# EAGLE schematic led-controller-hw (EAGLE 7.5.0)
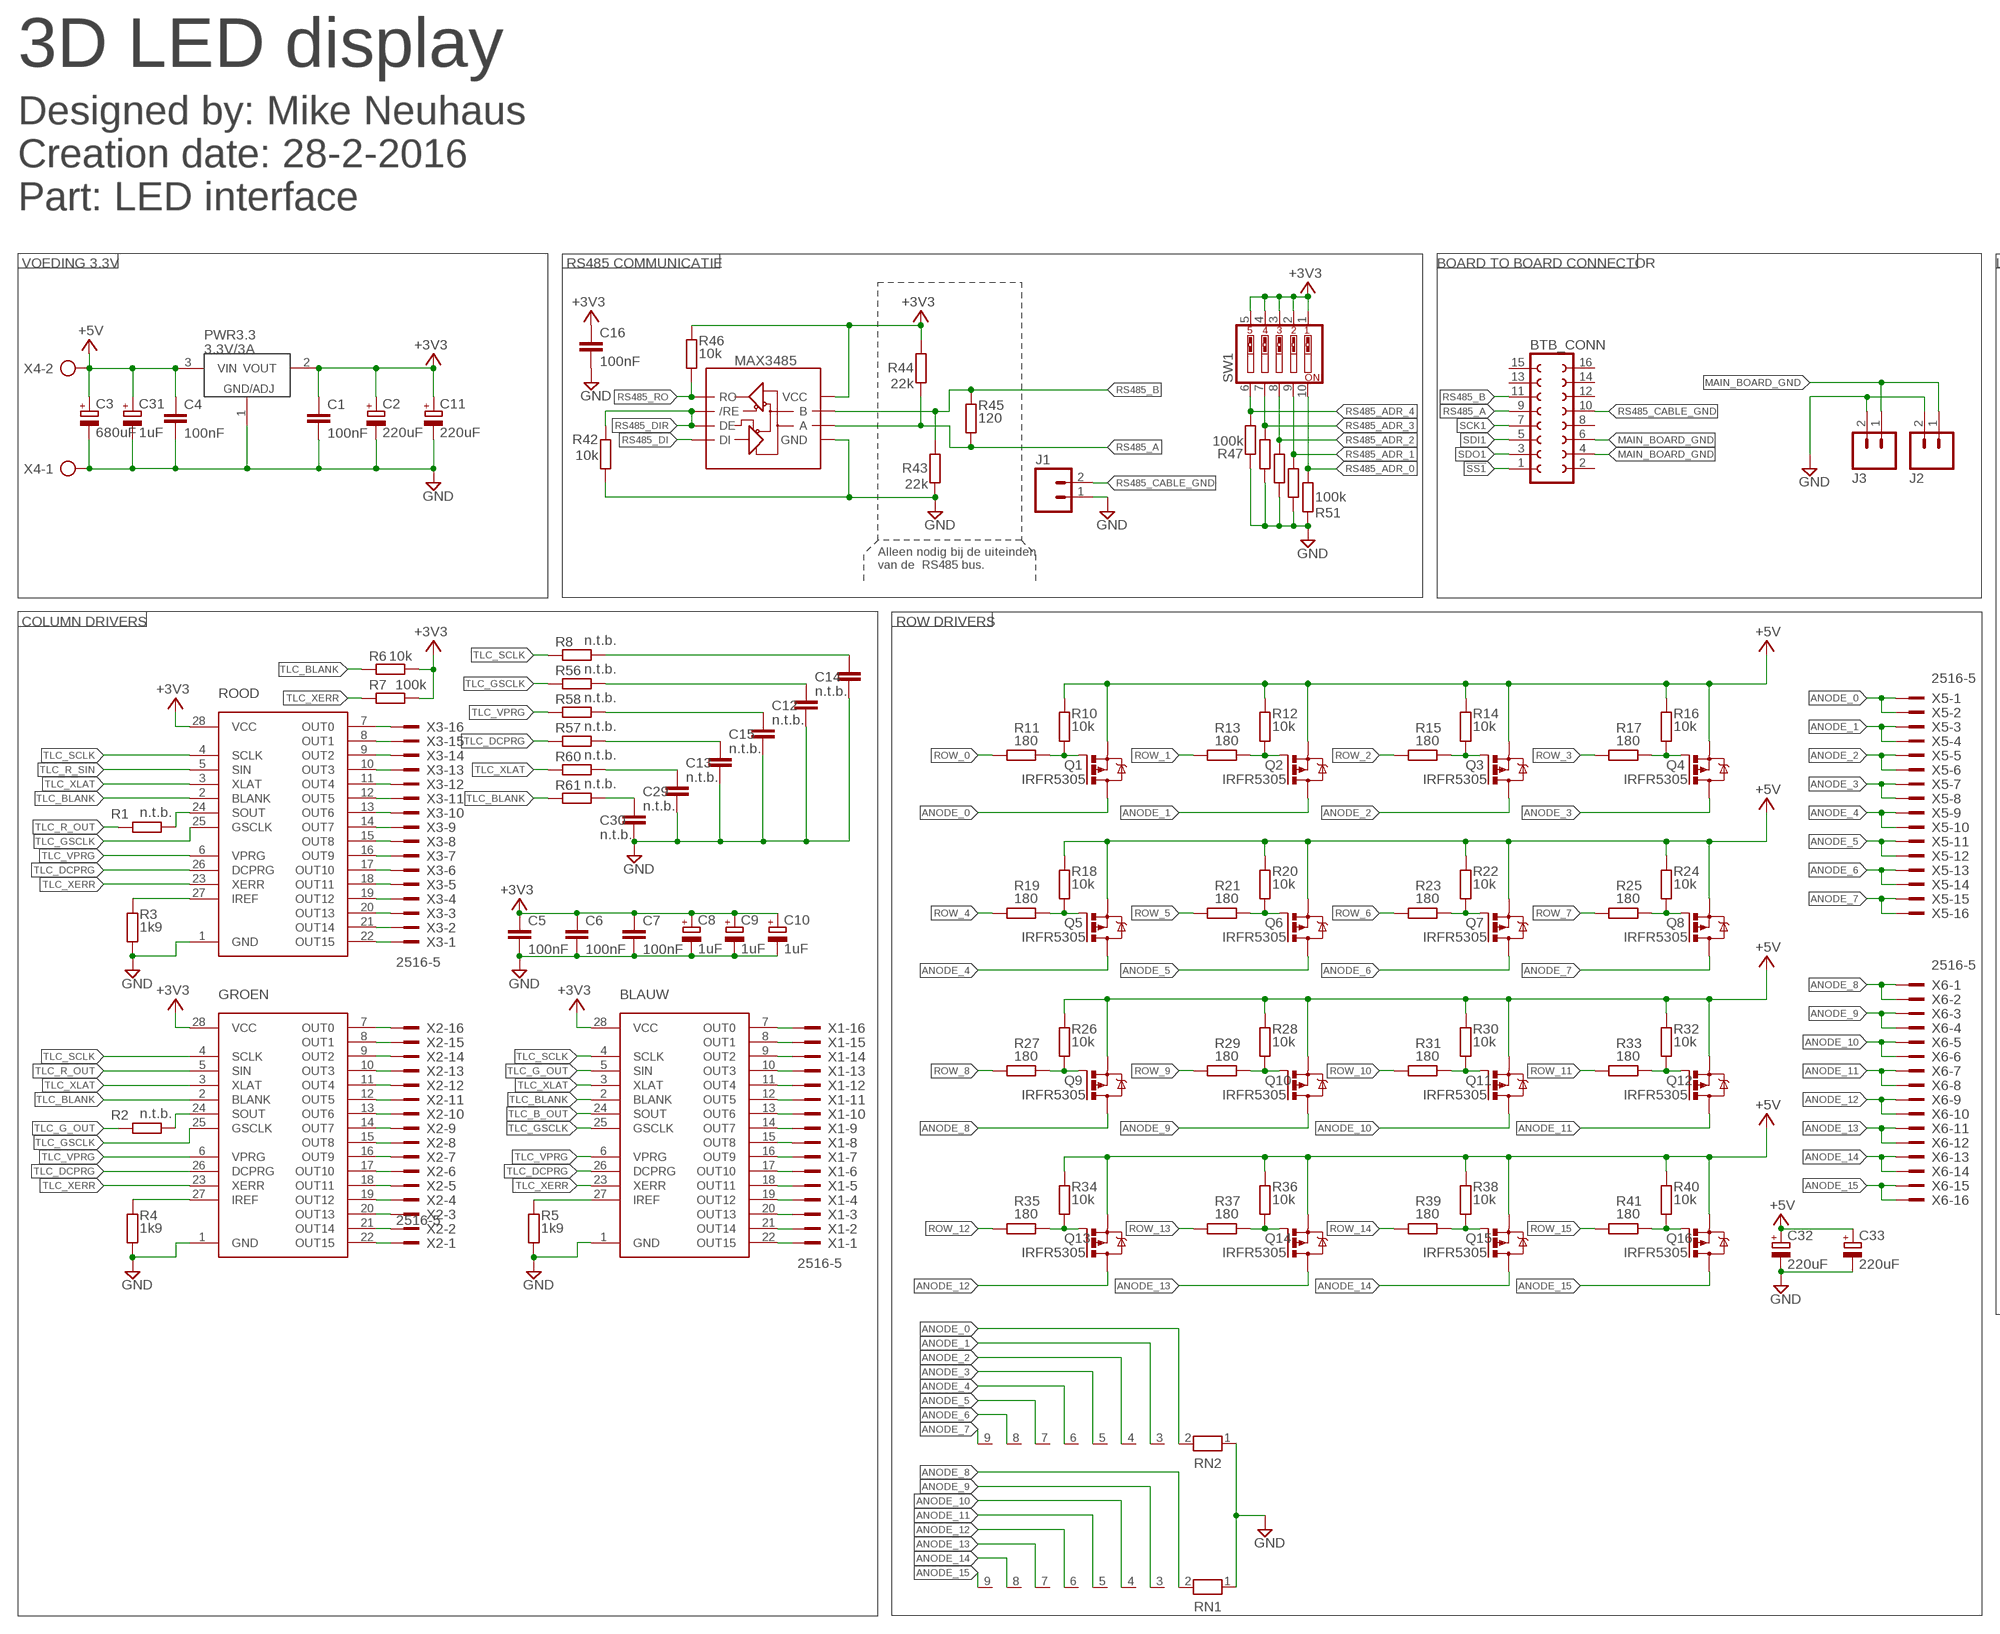
[diagram p0: schematic, sheet 1, part 1 of 2]
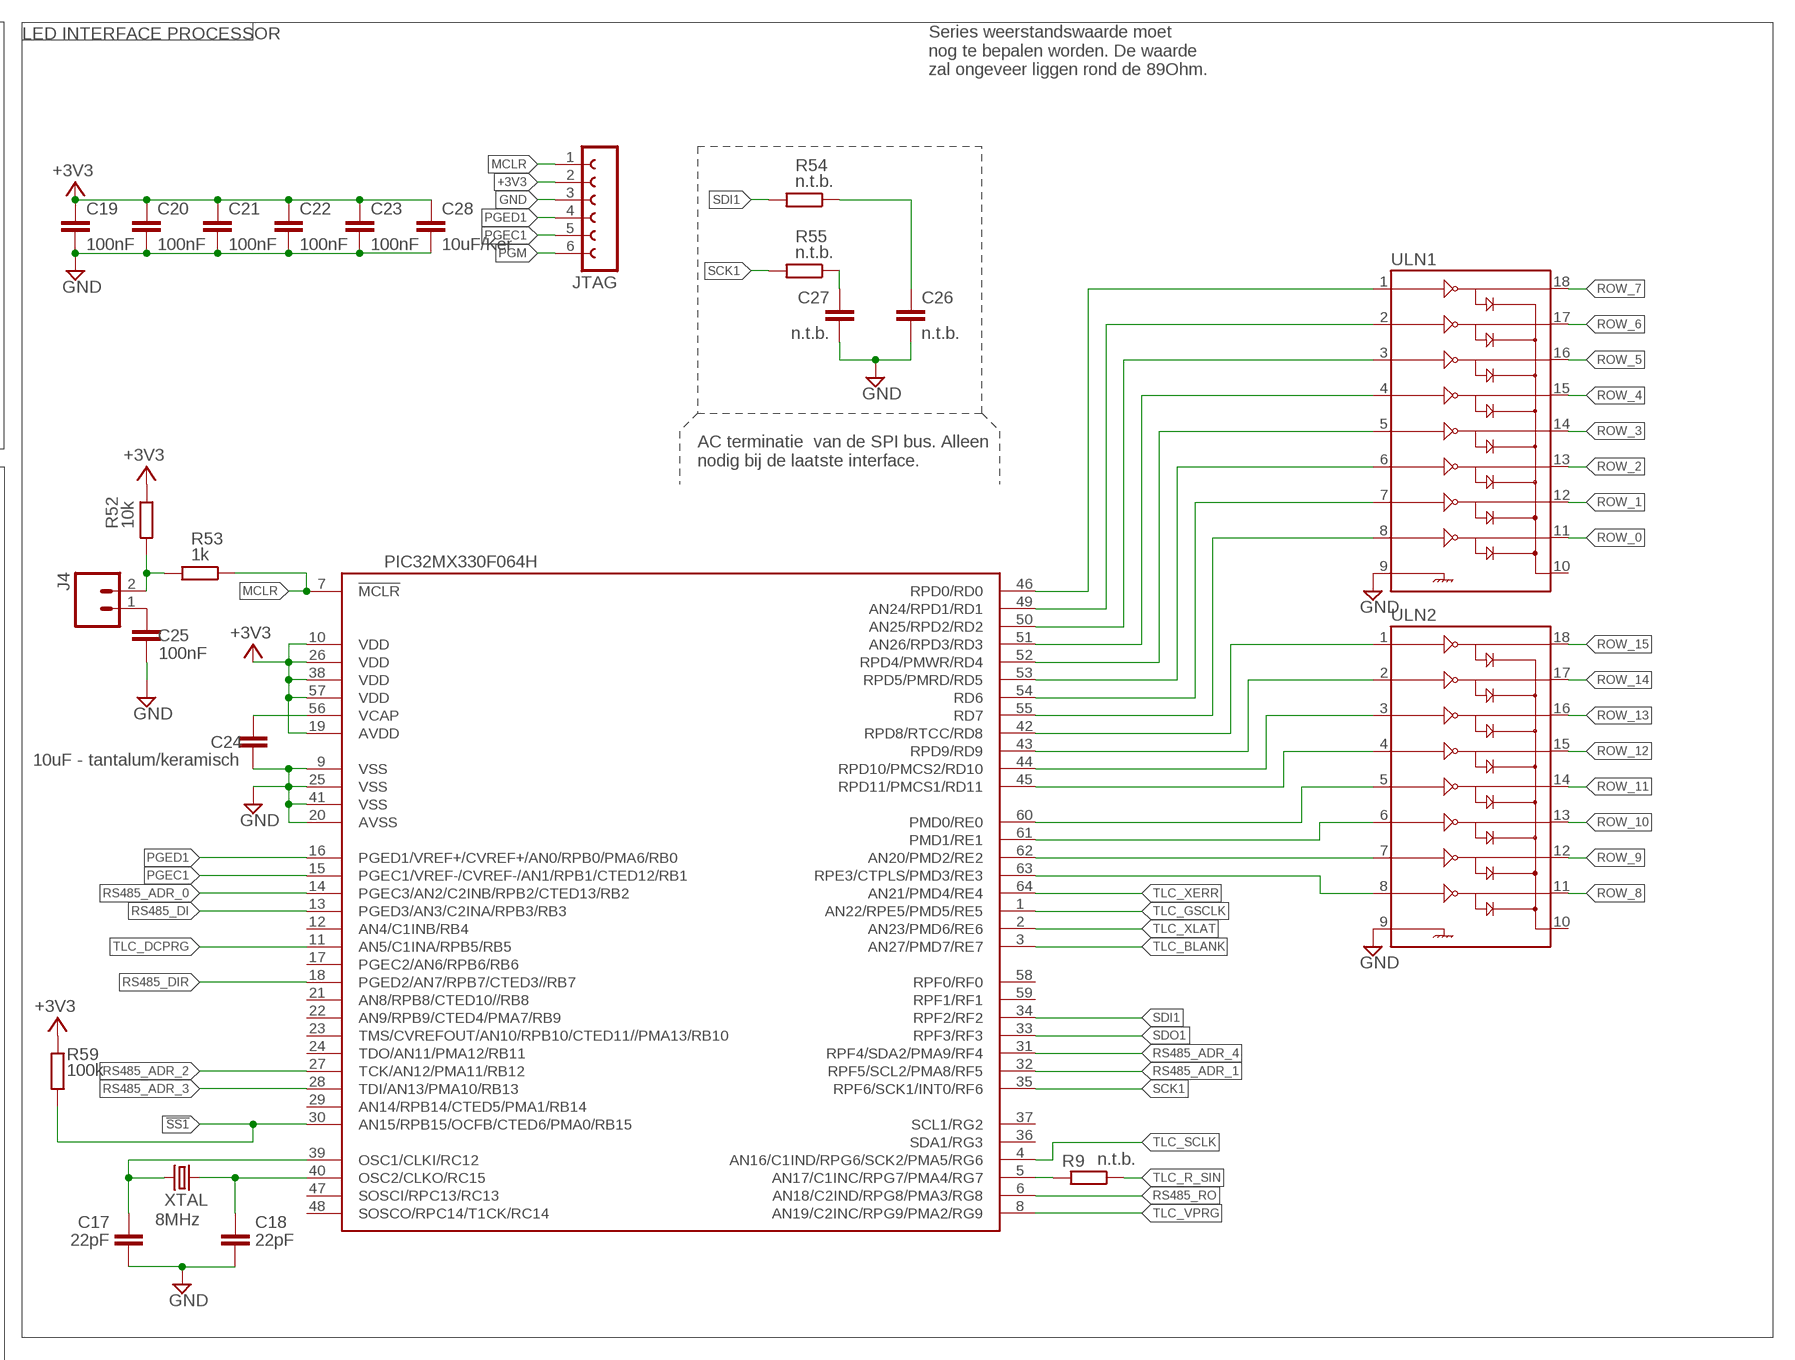
[diagram p1: schematic, sheet 1, part 2 of 2]

## Parts
BLAUW  TLC5940PWPR  [TSSOP-28-PWP]
BTB_CONN  FE08-2W  [FE08-2W]
C1  100nF  C-EUC0805  [C0805]
C2  220uF  CPOL-EUE2,5-6E  [E2,5-6E]
C3  680uF  CPOL_EU10-27-5  [CPOL_EU10-27]
C4  100nF  C-EUC0805  [C0805]
C5  100nF  C-EUC0805  [C0805]
C6  100nF  C-EUC0805  [C0805]
C7  100nF  C-EUC0805  [C0805]
C8  1uF  CPOL-EUE2.5-5  [E2,5-5]
C9  1uF  CPOL-EUE2.5-5  [E2,5-5]
C10  1uF  CPOL-EUE2.5-5  [E2,5-5]
C11  220uF  CPOL-EUE2,5-6E  [E2,5-6E]
C12  n.t.b.  C-EUC0805  [C0805]
C13  n.t.b.  C-EUC0805  [C0805]
C14  n.t.b.  C-EUC0805  [C0805]
C15  n.t.b.  C-EUC0805  [C0805]
C16  100nF  C-EUC0805  [C0805]
C17  22pF  C-EUC0805  [C0805]
C18  22pF  C-EUC0805  [C0805]
C19  100nF  C-EUC0805  [C0805]
C20  100nF  C-EUC0805  [C0805]
C21  100nF  C-EUC0805  [C0805]
C22  100nF  C-EUC0805  [C0805]
C23  100nF  C-EUC0805  [C0805]
C24  10uF - tantalum/keramisch  C-EUC0805  [C0805]
C25  100nF  C-EUC0805  [C0805]
C26  n.t.b.  C-EUC0805  [C0805]
C27  n.t.b.  C-EUC0805  [C0805]
C28  10uF/Ker  C-EUC0805  [C0805]
C29  n.t.b.  C-EUC0805  [C0805]
C30  n.t.b.  C-EUC0805  [C0805]
C31  1uF  CPOL-EUE2.5-5  [E2,5-5]
C32  220uF  CPOL-EUE2,5-6E  [E2,5-6E]
C33  220uF  CPOL-EUE2,5-6E  [E2,5-6E]
GROEN  TLC5940PWPR  [TSSOP-28-PWP]
J1  M02LOCK  [1X02_LOCK]
J2  M02LOCK  [1X02_LOCK]
J3  M02LOCK  [1X02_LOCK]
J4  M02LOCK  [1X02_LOCK]
JTAG  FE06-1  [FE06]
MAX3485  RS485SOIC  [SO08]
PIC32MX330F064H  PIC32MX330F064H  [TQFP-64-10]
PWR3.3  3.3V/3A  LM1085-3.3  [TO-220]
Q1  IRFR5305  [D-PAK_TO252AA]
Q2  IRFR5305  [D-PAK_TO252AA]
Q3  IRFR5305  [D-PAK_TO252AA]
Q4  IRFR5305  [D-PAK_TO252AA]
Q5  IRFR5305  [D-PAK_TO252AA]
Q6  IRFR5305  [D-PAK_TO252AA]
Q7  IRFR5305  [D-PAK_TO252AA]
Q8  IRFR5305  [D-PAK_TO252AA]
Q9  IRFR5305  [D-PAK_TO252AA]
Q10  IRFR5305  [D-PAK_TO252AA]
Q11  IRFR5305  [D-PAK_TO252AA]
Q12  IRFR5305  [D-PAK_TO252AA]
Q13  IRFR5305  [D-PAK_TO252AA]
Q14  IRFR5305  [D-PAK_TO252AA]
Q15  IRFR5305  [D-PAK_TO252AA]
Q16  IRFR5305  [D-PAK_TO252AA]
R1  n.t.b.  R-EU_M0805  [M0805]
R2  n.t.b.  R-EU_M0805  [M0805]
R3  1k9  R-EU_M0805  [M0805]
R4  1k9  R-EU_M0805  [M0805]
R5  1k9  R-EU_M0805  [M0805]
R6  10k  R-EU_M0805  [M0805]
R7  100k  R-EU_M0805  [M0805]
R8  n.t.b.  R-EU_M0805  [M0805]
R9  n.t.b.  R-EU_M0805  [M0805]
R10  10k  R-EU_M0805  [M0805]
R11  180  R-EU_M0805  [M0805]
R12  10k  R-EU_M0805  [M0805]
R13  180  R-EU_M0805  [M0805]
R14  10k  R-EU_M0805  [M0805]
R15  180  R-EU_M0805  [M0805]
R16  10k  R-EU_M0805  [M0805]
R17  180  R-EU_M0805  [M0805]
R18  10k  R-EU_M0805  [M0805]
R19  180  R-EU_M0805  [M0805]
R20  10k  R-EU_M0805  [M0805]
R21  180  R-EU_M0805  [M0805]
R22  10k  R-EU_M0805  [M0805]
R23  180  R-EU_M0805  [M0805]
R24  10k  R-EU_M0805  [M0805]
R25  180  R-EU_M0805  [M0805]
R26  10k  R-EU_M0805  [M0805]
R27  180  R-EU_M0805  [M0805]
R28  10k  R-EU_M0805  [M0805]
R29  180  R-EU_M0805  [M0805]
R30  10k  R-EU_M0805  [M0805]
R31  180  R-EU_M0805  [M0805]
R32  10k  R-EU_M0805  [M0805]
R33  180  R-EU_M0805  [M0805]
R34  10k  R-EU_M0805  [M0805]
R35  180  R-EU_M0805  [M0805]
R36  10k  R-EU_M0805  [M0805]
R37  180  R-EU_M0805  [M0805]
R38  10k  R-EU_M0805  [M0805]
R39  180  R-EU_M0805  [M0805]
R40  10k  R-EU_M0805  [M0805]
R41  180  R-EU_M0805  [M0805]
R42  10k  R-EU_M0805  [M0805]
R43  22k  R-EU_M0805  [M0805]
R44  22k  R-EU_M0805  [M0805]
R45  120  R-EU_M0805  [M0805]
R46  10k  R-EU_M0805  [M0805]
R47  100k  R-EU_M0805  [M0805]
R48  100k  R-EU_M0805  [M0805]
R49  100k  R-EU_M0805  [M0805]
R50  100k  R-EU_M0805  [M0805]
R51  100k  R-EU_M0805  [M0805]
R52  10k  R-EU_M0805  [M0805]
R53  1k  R-EU_M0805  [M0805]
R54  n.t.b.  R-EU_M0805  [M0805]
R55  n.t.b.  R-EU_M0805  [M0805]
R56  n.t.b.  R-EU_M0805  [M0805]
R57  n.t.b.  R-EU_M0805  [M0805]
R58  n.t.b.  R-EU_M0805  [M0805]
R59  100k  R-EU_M0805  [M0805]
R60  n.t.b.  R-EU_M0805  [M0805]
R61  n.t.b.  R-EU_M0805  [M0805]
RN1  RN08  [RN-9]
RN2  RN08  [RN-9]
ROOD  TLC5940PWPR  [TSSOP-28-PWP]
SW1  SW_DIP-5  [EDG-05]
ULN1  ULN2803SOICW  [SO18L]
ULN2  ULN2803SOICW  [SO18L]
X1  2516-5  [PAK100/2500-5-16]
X2  2516-5  [PAK100/2500-5-16]
X3  2516-5  [PAK100/2500-5-16]
X4  AK500/2-H  [AK500/2-H]
X5  2516-5  [PAK100/2500-5-16]
X6  2516-5  [PAK100/2500-5-16]
XTAL  8MHz  CSM-7X-DU  [CSM-7X-DU]

## Nets
!SS1: BTB_CONN.1 PIC32MX330F064H.30(AN15/RPB15/OCFB/CTED6/PMA0/RB15) R59.2
+3V3: BLAUW.28(VCC) C1.1 C2.+ C5.1 C6.1 C7.1 C8.+ C9.+ C10.+ C11.+ C16.1 C19.1 C20.1 C21.1 C22.1 C23.1 C28.1 GROEN.28(VCC) JTAG.2 MAX3485.8(VCC) PIC32MX330F064H.10(VDD) PIC32MX330F064H.19(AVDD) PIC32MX330F064H.26(VDD) PIC32MX330F064H.38(VDD) PIC32MX330F064H.57(VDD) PWR3.3.2(VOUT) R6.2 R7.2 R44.1 R46.2 R52.1 R59.1 ROOD.28(VCC) SW1.1 SW1.2 SW1.3 SW1.4 SW1.5
+5V: C3.1(+) C4.1 C31.+ C32.+ C33.+ PWR3.3.3(VIN) Q1.3(S) Q2.3(S) Q3.3(S) Q4.3(S) Q5.3(S) Q6.3(S) Q7.3(S) Q8.3(S) Q9.3(S) Q10.3(S) Q11.3(S) Q12.3(S) Q13.3(S) Q14.3(S) Q15.3(S) Q16.3(S) R10.2 R12.2 R14.2 R16.2 R18.2 R20.2 R22.2 R24.2 R26.2 R28.2 R30.2 R32.2 R34.2 R36.2 R38.2 R40.2 X4.2
ANODE_0: Q1.4(D) RN2.2 X5.1 X5.2
ANODE_1: Q2.4(D) RN2.3 X5.3 X5.4
ANODE_2: Q3.4(D) RN2.4 X5.5 X5.6
ANODE_3: Q4.4(D) RN2.5 X5.7 X5.8
ANODE_4: Q5.4(D) RN2.6 X5.9 X5.10
ANODE_5: Q6.4(D) RN2.7 X5.11 X5.12
ANODE_6: Q7.4(D) RN2.8 X5.13 X5.14
ANODE_7: Q8.4(D) RN2.9 X5.15 X5.16
ANODE_8: Q9.4(D) RN1.2 X6.1 X6.2
ANODE_9: Q10.4(D) RN1.3 X6.3 X6.4
ANODE_10: Q11.4(D) RN1.4 X6.5 X6.6
ANODE_11: Q12.4(D) RN1.5 X6.7 X6.8
ANODE_12: Q13.4(D) RN1.6 X6.9 X6.10
ANODE_13: Q14.4(D) RN1.7 X6.11 X6.12
ANODE_14: Q15.4(D) RN1.8 X6.13 X6.14
ANODE_15: Q16.4(D) RN1.9 X6.15 X6.16
GND: BLAUW.1(GND) C1.2 C2.- C3.2(-) C4.2 C5.2 C6.2 C7.2 C8.- C9.- C10.- C11.- C12.2 C13.2 C14.2 C15.2 C16.2 C17.1 C18.1 C19.2 C20.2 C21.2 C22.2 C23.2 C24.2 C25.2 C26.2 C27.2 C28.2 C29.2 C30.2 C31.- C32.- C33.- GROEN.1(GND) J1.1 J2.2 J3.2 JTAG.3 MAX3485.5(GND) PIC32MX330F064H.9(VSS) PIC32MX330F064H.20(AVSS) PIC32MX330F064H.25(VSS) PIC32MX330F064H.41(VSS) PWR3.3.1(GND/ADJ) R3.1 R4.1 R5.1 R42.2 R43.2 R47.1 R48.1 R49.1 R50.1 R51.1 RN1.1 RN2.1 ROOD.1(GND) ULN1.9 ULN2.9 X4.1
MAIN_BOARD_GND: BTB_CONN.4 BTB_CONN.6 J2.1 J3.1
MCLR: JTAG.1 PIC32MX330F064H.7(!MCLR) R53.1
N$1: C13.1 R57.1
N$2: Q1.1(G) R10.1 R11.1
N$3: R3.2 ROOD.27(IREF)
N$4: BLAUW.27(IREF) R5.2
N$5: GROEN.27(IREF) R4.2
N$6: ROOD.22(OUT15) X3.1
N$7: ROOD.21(OUT14) X3.2
N$8: ROOD.20(OUT13) X3.3
N$9: ROOD.19(OUT12) X3.4
N$10: ROOD.18(OUT11) X3.5
N$11: ROOD.17(OUT10) X3.6
N$12: ROOD.16(OUT9) X3.7
N$13: ROOD.15(OUT8) X3.8
N$14: ROOD.14(OUT7) X3.9
N$15: ROOD.13(OUT6) X3.10
N$16: ROOD.12(OUT5) X3.11
N$17: ROOD.11(OUT4) X3.12
N$18: ROOD.10(OUT3) X3.13
N$19: ROOD.9(OUT2) X3.14
N$20: ROOD.8(OUT1) X3.15
N$21: ROOD.7(OUT0) X3.16
N$22: GROEN.20(OUT13) X2.3
N$23: GROEN.22(OUT15) X2.1
N$24: GROEN.21(OUT14) X2.2
N$25: GROEN.19(OUT12) X2.4
N$26: GROEN.18(OUT11) X2.5
N$27: GROEN.17(OUT10) X2.6
N$28: GROEN.16(OUT9) X2.7
N$29: GROEN.15(OUT8) X2.8
N$30: GROEN.14(OUT7) X2.9
N$31: GROEN.13(OUT6) X2.10
N$32: GROEN.12(OUT5) X2.11
N$33: GROEN.11(OUT4) X2.12
N$34: GROEN.10(OUT3) X2.13
N$35: GROEN.9(OUT2) X2.14
N$36: GROEN.8(OUT1) X2.15
N$37: GROEN.7(OUT0) X2.16
N$38: BLAUW.15(OUT8) X1.8
N$39: BLAUW.7(OUT0) X1.16
N$40: BLAUW.8(OUT1) X1.15
N$41: BLAUW.9(OUT2) X1.14
N$42: BLAUW.10(OUT3) X1.13
N$43: BLAUW.11(OUT4) X1.12
N$44: BLAUW.12(OUT5) X1.11
N$45: BLAUW.13(OUT6) X1.10
N$46: BLAUW.14(OUT7) X1.9
N$47: BLAUW.16(OUT9) X1.7
N$48: BLAUW.17(OUT10) X1.6
N$49: BLAUW.18(OUT11) X1.5
N$50: BLAUW.19(OUT12) X1.4
N$51: BLAUW.20(OUT13) X1.3
N$52: BLAUW.21(OUT14) X1.2
N$53: BLAUW.22(OUT15) X1.1
N$54: C12.1 R56.1
N$55: Q2.1(G) R12.1 R13.1
N$56: Q6.1(G) R20.1 R21.1
N$57: Q3.1(G) R14.1 R15.1
N$58: C18.2 PIC32MX330F064H.40(OSC2/CLKO/RC15) XTAL.1
N$59: Q4.1(G) R16.1 R17.1
N$60: C17.2 PIC32MX330F064H.39(OSC1/CLKI/RC12) XTAL.2
N$61: Q5.1(G) R18.1 R19.1
N$62: C25.1 J4.1
N$63: Q7.1(G) R22.1 R23.1
N$64: J4.2 R52.2 R53.2
N$65: C26.1 R54.1
N$66: Q8.1(G) R24.1 R25.1
N$67: C27.1 R55.1
N$68: R1.1 ROOD.24(SOUT)
N$69: Q9.1(G) R26.1 R27.1
N$70: GROEN.24(SOUT) R2.1
N$71: C14.1 R8.1
N$72: Q10.1(G) R28.1 R29.1
N$73: C15.1 R58.1
N$74: C29.1 R60.1
N$75: Q11.1(G) R30.1 R31.1
N$76: C30.1 R61.1
N$77: PIC32MX330F064H.5(AN17/C1INC/RPG7/PMA4/RG7) R9.2
N$78: Q12.1(G) R32.1 R33.1
N$79: PIC32MX330F064H.46(RPD0/RD0) ULN1.1
N$80: PIC32MX330F064H.49(AN24/RPD1/RD1) ULN1.2
N$81: Q13.1(G) R34.1 R35.1
N$82: PIC32MX330F064H.50(AN25/RPD2/RD2) ULN1.3
N$83: PIC32MX330F064H.51(AN26/RPD3/RD3) ULN1.4
N$84: Q14.1(G) R36.1 R37.1
N$85: PIC32MX330F064H.52(RPD4/PMWR/RD4) ULN1.5
N$86: PIC32MX330F064H.53(RPD5/PMRD/RD5) ULN1.6
N$87: Q15.1(G) R38.1 R39.1
N$88: PIC32MX330F064H.54(RD6) ULN1.7
N$89: PIC32MX330F064H.55(RD7) ULN1.8
N$90: Q16.1(G) R40.1 R41.1
N$92: PIC32MX330F064H.42(RPD8/RTCC/RD8) ULN2.1
N$93: PIC32MX330F064H.43(RPD9/RD9) ULN2.2
N$94: PIC32MX330F064H.44(RPD10/PMCS2/RD10) ULN2.3
N$95: PIC32MX330F064H.45(RPD11/PMCS1/RD11) ULN2.4
N$96: PIC32MX330F064H.60(PMD0/RE0) ULN2.5
N$97: PIC32MX330F064H.61(PMD1/RE1) ULN2.6
N$98: PIC32MX330F064H.62(AN20/PMD2/RE2) ULN2.7
N$99: PIC32MX330F064H.63(RPE3/CTPLS/PMD3/RE3) ULN2.8
PGEC1: JTAG.5 PIC32MX330F064H.15(PGEC1/VREF-/CVREF-/AN1/RPB1/CTED12/RB1)
PGED1: JTAG.4 PIC32MX330F064H.16(PGED1/VREF+/CVREF+/AN0/RPB0/PMA6/RB0)
PGM: JTAG.6
ROW_0: R11.2 ULN1.11
ROW_1: R13.2 ULN1.12
ROW_2: R15.2 ULN1.13
ROW_3: R17.2 ULN1.14
ROW_4: R19.2 ULN1.15
ROW_5: R21.2 ULN1.16
ROW_6: R23.2 ULN1.17
ROW_7: R25.2 ULN1.18
ROW_8: R27.2 ULN2.11
ROW_9: R29.2 ULN2.12
ROW_10: R31.2 ULN2.13
ROW_11: R33.2 ULN2.14
ROW_12: R35.2 ULN2.15
ROW_13: R37.2 ULN2.16
ROW_14: R39.2 ULN2.17
ROW_15: R41.2 ULN2.18
RS485_A: BTB_CONN.9 MAX3485.6(A) R44.2 R45.1
RS485_ADR_0: PIC32MX330F064H.14(PGEC3/AN2/C2INB/RPB2/CTED13/RB2) R51.2 SW1.10
RS485_ADR_1: PIC32MX330F064H.32(RPF5/SCL2/PMA8/RF5) R50.2 SW1.9
RS485_ADR_2: PIC32MX330F064H.27(TCK/AN12/PMA11/RB12) R49.2 SW1.8
RS485_ADR_3: PIC32MX330F064H.28(TDI/AN13/PMA10/RB13) R48.2 SW1.7
RS485_ADR_4: PIC32MX330F064H.31(RPF4/SDA2/PMA9/RF4) R47.2 SW1.6
RS485_B: BTB_CONN.11 MAX3485.7(B) R43.1 R45.2
RS485_CABLE_GND: BTB_CONN.10 J1.2
RS485_DI: MAX3485.4(DI) PIC32MX330F064H.13(PGED3/AN3/C2INA/RPB3/RB3)
RS485_DIR: MAX3485.2(/RE) MAX3485.3(DE) PIC32MX330F064H.18(PGED2/AN7/RPB7/CTED3//RB7) R42.1
RS485_RO: MAX3485.1(RO) PIC32MX330F064H.6(AN18/C2IND/RPG8/PMA3/RG8) R46.1
SCK1: BTB_CONN.7 PIC32MX330F064H.35(RPF6/SCK1/INT0/RF6) R55.2
SDI1: BTB_CONN.5 PIC32MX330F064H.34(RPF2/RF2) R54.2
SDO1: BTB_CONN.3 PIC32MX330F064H.33(RPF3/RF3)
TLC_B_OUT: BLAUW.24(SOUT)
TLC_BLANK: BLAUW.2(BLANK) GROEN.2(BLANK) PIC32MX330F064H.3(AN27/PMD7/RE7) R6.1 R61.2 ROOD.2(BLANK)
TLC_DCPRG: BLAUW.26(DCPRG) GROEN.26(DCPRG) PIC32MX330F064H.11(AN5/C1INA/RPB5/RB5) R57.2 ROOD.26(DCPRG)
TLC_G_OUT: BLAUW.5(SIN) R2.2
TLC_GSCLK: BLAUW.25(GSCLK) GROEN.25(GSCLK) PIC32MX330F064H.1(AN22/RPE5/PMD5/RE5) R56.2 ROOD.25(GSCLK)
TLC_R_OUT: GROEN.5(SIN) R1.2
TLC_R_SIN: R9.1 ROOD.5(SIN)
TLC_SCLK: BLAUW.4(SCLK) GROEN.4(SCLK) PIC32MX330F064H.4(AN16/C1IND/RPG6/SCK2/PMA5/RG6) R8.2 ROOD.4(SCLK)
TLC_VPRG: BLAUW.6(VPRG) GROEN.6(VPRG) PIC32MX330F064H.8(AN19/C2INC/RPG9/PMA2/RG9) R58.2 ROOD.6(VPRG)
TLC_XERR: BLAUW.23(XERR) GROEN.23(XERR) PIC32MX330F064H.64(AN21/PMD4/RE4) R7.1 ROOD.23(XERR)
TLC_XLAT: BLAUW.3(XLAT) GROEN.3(XLAT) PIC32MX330F064H.2(AN23/PMD6/RE6) R60.2 ROOD.3(XLAT)
VCAP: C24.1 PIC32MX330F064H.56(VCAP)
Unconnected: BTB_CONN.2 BTB_CONN.8 BTB_CONN.12 BTB_CONN.13 BTB_CONN.14 BTB_CONN.15 BTB_CONN.16 PIC32MX330F064H.12(AN4/C1INB/RB4) PIC32MX330F064H.17(PGEC2/AN6/RPB6/RB6) PIC32MX330F064H.21(AN8/RPB8/CTED10//RB8) PIC32MX330F064H.22(AN9/RPB9/CTED4/PMA7/RB9) PIC32MX330F064H.23(TMS/CVREFOUT/AN10/RPB10/CTED11//PMA13/RB10) PIC32MX330F064H.24(TDO/AN11/PMA12/RB11) PIC32MX330F064H.29(AN14/RPB14/CTED5/PMA1/RB14) PIC32MX330F064H.36(SDA1/RG3) PIC32MX330F064H.37(SCL1/RG2) PIC32MX330F064H.47(SOSCI/RPC13/RC13) PIC32MX330F064H.48(SOSCO/RPC14/T1CK/RC14) PIC32MX330F064H.58(RPF0/RF0) PIC32MX330F064H.59(RPF1/RF1) ULN1.10 ULN2.10

## Notes on the sheet
- 3D LED display
- Designed by: Mike Neuhaus
  Creation date: 28-2-2016
  Part: LED interface
- VOEDING 3.3V | RS485 COMMUNICATIE | BOARD TO BOARD CONNECTOR | LED INTERFACE PROCESSOR
- Series weerstandswaarde moet 
  nog te bepalen worden. De waarde
  zal ongeveer liggen rond de 89Ohm.
- Alleen nodig bij de uiteinden 
  van de  RS485 bus.
- AC terminatie  van de SPI bus. Alleen 
  nodig bij de laatste interface.
- COLUMN DRIVERS | ROW DRIVERS

## Library data of the parts
BLAUW GROEN ROOD = LED driver:TLC5940PWPR
BTB_CONN = con-lsta:FE08-2W: FEMALE HEADER; OC_FARNELL: unknown; OC_NEWARK: unknown
C1 C4-C7 C12-C30 = rcl:C-EU: CAPACITOR, European symbol
C2 C8-C11 C31-C33 = rcl:CPOL-EU: POLARIZED CAPACITOR, European symbol
C3 = LED driver:CPOL_EU10-27-5
J1-J4 = SparkFun-Connectors:M02: Standard 2-pin 0.1" header. Use with - straight break away headers ( PRT-00116) - right angle break away headers (PRT-00553) - swiss pins (PRT-00743) - machine pins (PRT-00117) - female headers (PRT-00115) Molex polarized connector foot print use with: PRT-08233 with associated crimp pins and housings. 2.54_SCREWTERM for use with PRT-10571. 3.5mm Screw Terminal footprints for PRT-08084 5mm Screw Terminal footprints for use with PRT-08432
JTAG = con-lsta:FE06-1: FEMALE HEADER; OC_FARNELL: unknown; OC_NEWARK: unknown
MAX3485 = SparkFun-DigitalIC:RS485: RS485 transceiver
PIC32MX330F064H = LED driver:PIC32MX330F064H
PWR3.3 = LED driver:LM1085-3.3
Q1-Q16 = transistor-power:IRF?5305: HEXFET Power MOSFET Source: http://www.irf.com/product-info/datasheets/data/irfr5305pbf.pdf
R1-R61 = resistor:R-EU_: RESISTOR, European symbol
RN1 RN2 = resistor-net:RN08: RESISTOR NETWORK; OC_FARNELL: unknown; OC_NEWARK: unknown
SW1 = special:SW_DIP-5: DIP SWITCH
ULN1 ULN2 = SparkFun-PowerIC:ULN2803: Darlington Driver ULN2803 Darlington array. 500mA max per channel, 8-channel package. Spark Fun Electronics SKU : COM-00312
X1-X3 X5 X6 = con-3m:2516-: 3M (TM) Pak 100 4-Wall Header Source: 3M; MPN: D2516-5002-AR; OC_FARNELL: 9838376; OC_NEWARK: 12P7055
X4 = con-ptr500:AK500/2-H: CONNECTOR Aug. 2004 / PTR Meßtechnik: Die Bezeichnung der Serie AK505 wurde geändert. Es handelt sich hierbei um AK500 in horizontaler Ausführung.; OC_FARNELL: unknown; OC_NEWARK: unknown
XTAL = crystal:CSM-7X-DU: SMD CRYSTAL Source: www.ecsxtal.com .. Crystal 3.6864MHz CSM_7X_DU.PDF; OC_FARNELL: unknown; OC_NEWARK: unknown